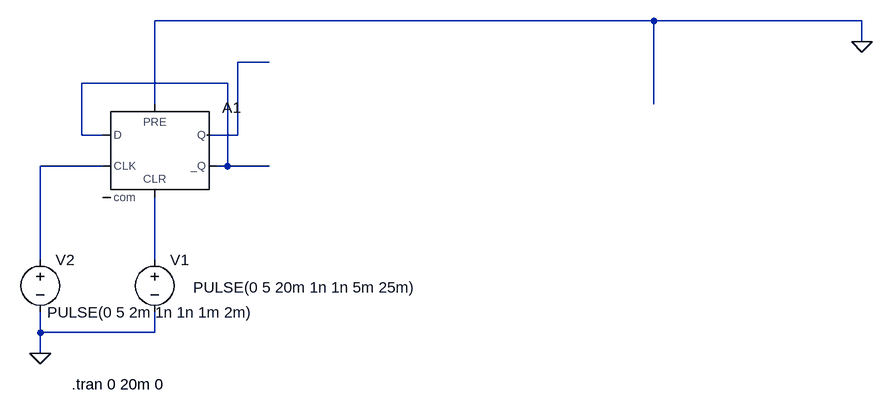
[diagram p0: schematic D_FlipFlop.asc]
D_FlipFlop.asc, the LTspice schematic file:
Version 4
SHEET 1 1056 680
WIRE 720 96 -48 96
WIRE 1040 96 720 96
WIRE 1040 128 1040 96
WIRE 128 160 80 160
WIRE 64 192 -160 192
WIRE -48 224 -48 96
WIRE 720 224 720 96
WIRE -160 272 -160 192
WIRE -128 272 -160 272
WIRE 80 272 80 160
WIRE 80 272 32 272
WIRE -128 320 -224 320
WIRE 64 320 64 192
WIRE 64 320 48 320
WIRE 128 320 64 320
WIRE -224 464 -224 320
WIRE -48 464 -48 368
WIRE -224 576 -224 544
WIRE -48 576 -48 544
WIRE -48 576 -224 576
WIRE -224 608 -224 576
FLAG -224 608 0
FLAG 1040 128 0
SYMBOL dflop -48 224 R0
SYMATTR InstName A1
SYMATTR SpiceLine Vhigh 5 Trise 1n
SYMBOL voltage -48 448 R0
WINDOW 3 59 59 Left 2
SYMATTR Value PULSE(0 5 20m 1n 1n 5m 25m)
SYMATTR InstName V1
SYMBOL voltage -224 448 R0
WINDOW 3 11 97 Left 2
SYMATTR Value PULSE(0 5 2m 1n 1n 1m 2m)
SYMATTR InstName V2
TEXT -176 656 Left 2 !.tran 0 20m 0

The netlist it stands for:
* D_FlipFlop.asc
A1 N002 0 N003 0 N004 N002 N001 0 DFLOP Vhigh 5 Trise 1n
V1 N004 0 PULSE(0 5 20m 1n 1n 5m 25m)
V2 N003 0 PULSE(0 5 2m 1n 1n 1m 2m)
.tran 0 20m 0
.backanno
.end